# EasyEDA schematic SCH_LM386-AMP-MONO_2026-03-15.json
TITLE: Sheet_1; REV: 1.0; Date: 2026-03-10; Sheet: 1/1; Drawn By: Trividha; Company: Your Company
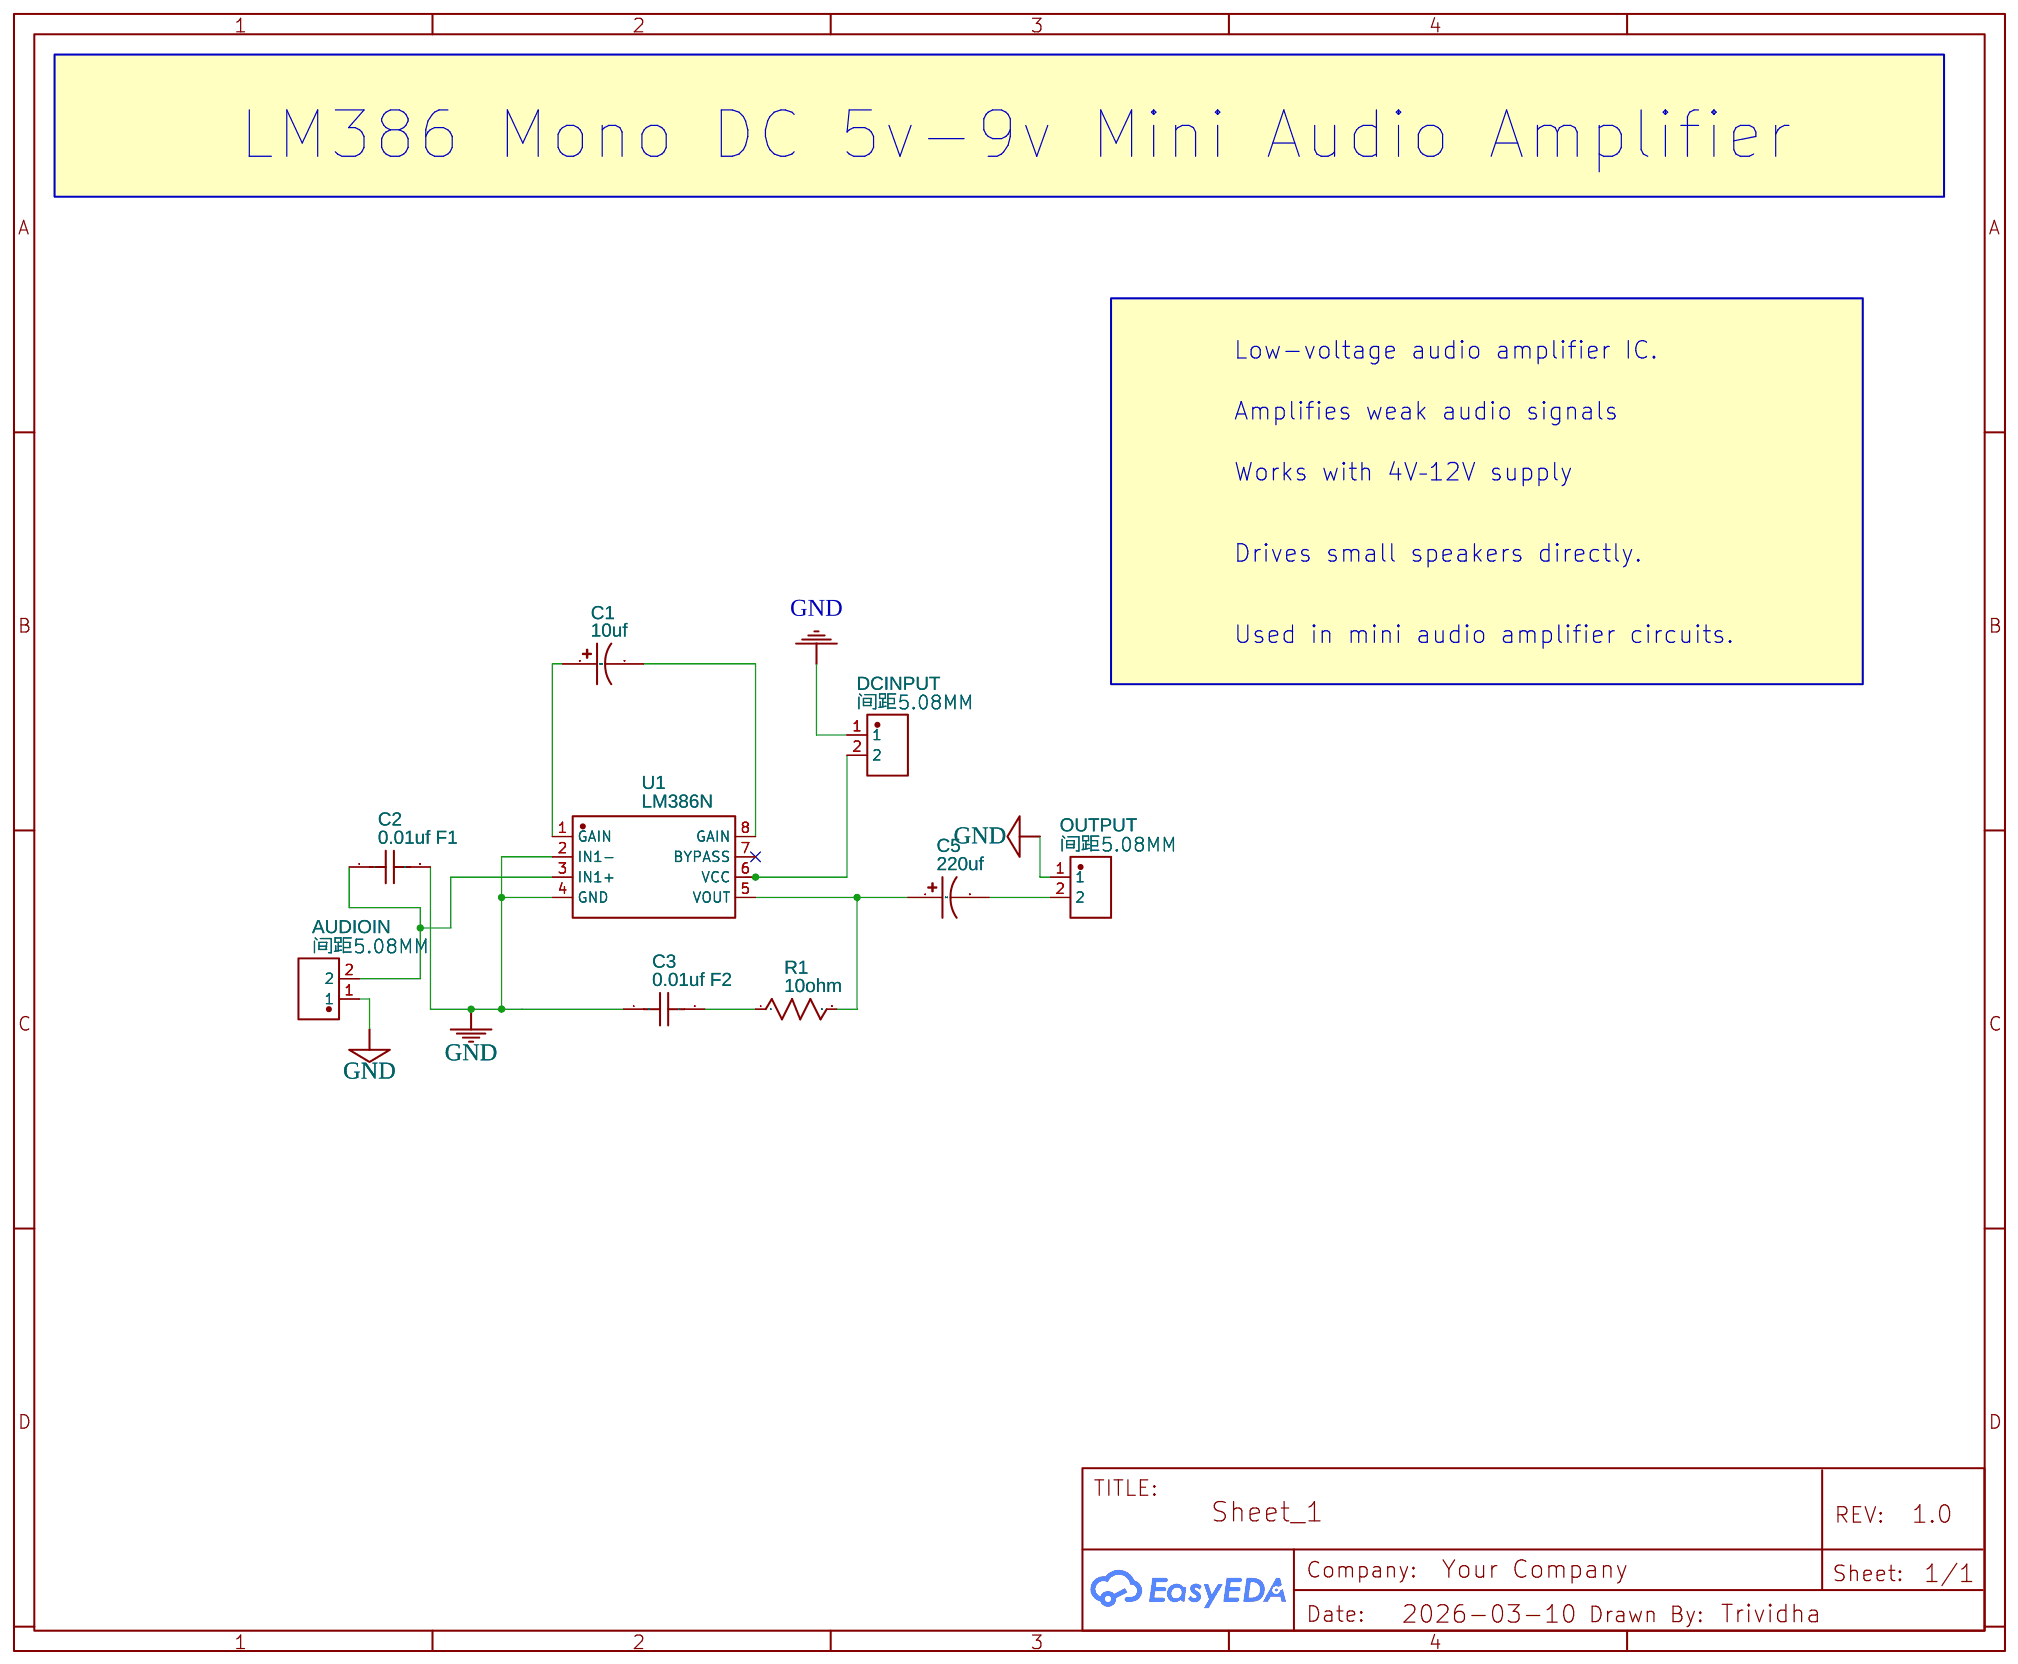
[diagram p0: schematic sheet]

## Parts
AUDIOIN  间距5.08MM  [CONN-TH_WJ2EDGVC-5.08-2P]
C1  10uf  [CASE-A_3216]
C2  0.01uf F1  [C0603]
C3  0.01uf F2  [RAD-0.1]
C5  220uf  [CASE-A_3216]
DCINPUT  间距5.08MM  [CONN-TH_WJ2EDGVC-5.08-2P]
OUTPUT  间距5.08MM  [CONN-TH_WJ2EDGVC-5.08-2P]
R1  10ohm  [R_AXIAL-0.3]
U1  LM386N  [DIP-8_L9.7-W6.4-P2.54-LS7.6-BL]

## Library data of the parts
AUDIOIN DCINPUT OUTPUT = 间距5.08MM: Contributor: lcsc; Supplier: LCSC; Supplier Part: C9900021608; Manufacturer: null; JLCPCB Part Class: Extended Part
C1 C5 = C_Tan_SMD_A_US: Contributor: LCEDA_Lib
C2 = C_0603_US: Contributor: LCEDA_Lib
C3 = C_RAD-0.1_US: Contributor: LCEDA_Lib
R1 = R_AXIAL-0.3_US: Contributor: LCEDA_Lib
U1 = LM386N: Contributor: LCSC; Supplier: LCSC; Supplier Part: C510561; Manufacturer: HTC; JLCPCB Part Class: Extended Part

## Nets
GND: AUDIOIN.1 C2.2 C3.1 DCINPUT.1 OUTPUT.1 U1.2(IN1-) U1.4(GND)
Net-(AUDIOIN-2): AUDIOIN.2 C2.1 U1.3(IN1+)
Net-(C1-1): C1.1 U1.1(GAIN)
Net-(C1-2): C1.2 U1.8(GAIN)
Net-(C3-2): C3.2 R1.1
Net-(C5-1): C5.1 R1.2 U1.5(VOUT)
Net-(C5-2): C5.2 OUTPUT.2
Net-(DCINPUT-2): DCINPUT.2 U1.6(VCC)

Not connected (* = marked no-connect by the designer): U1 7(BYPASS)*

## Notes on the sheet
- LM386 Mono DC 5v-9v Mini Audio Amplifier
- Low-voltage audio amplifier IC.
- Amplifies weak audio signals
- Works with 4V–12V supply
- Drives small speakers directly.
- Used in mini audio amplifier circuits.
